# Altium schematic sheet Power19V.SchDoc
size 375 x 157 mm; SheetNumber: 1; SheetTotal: 1
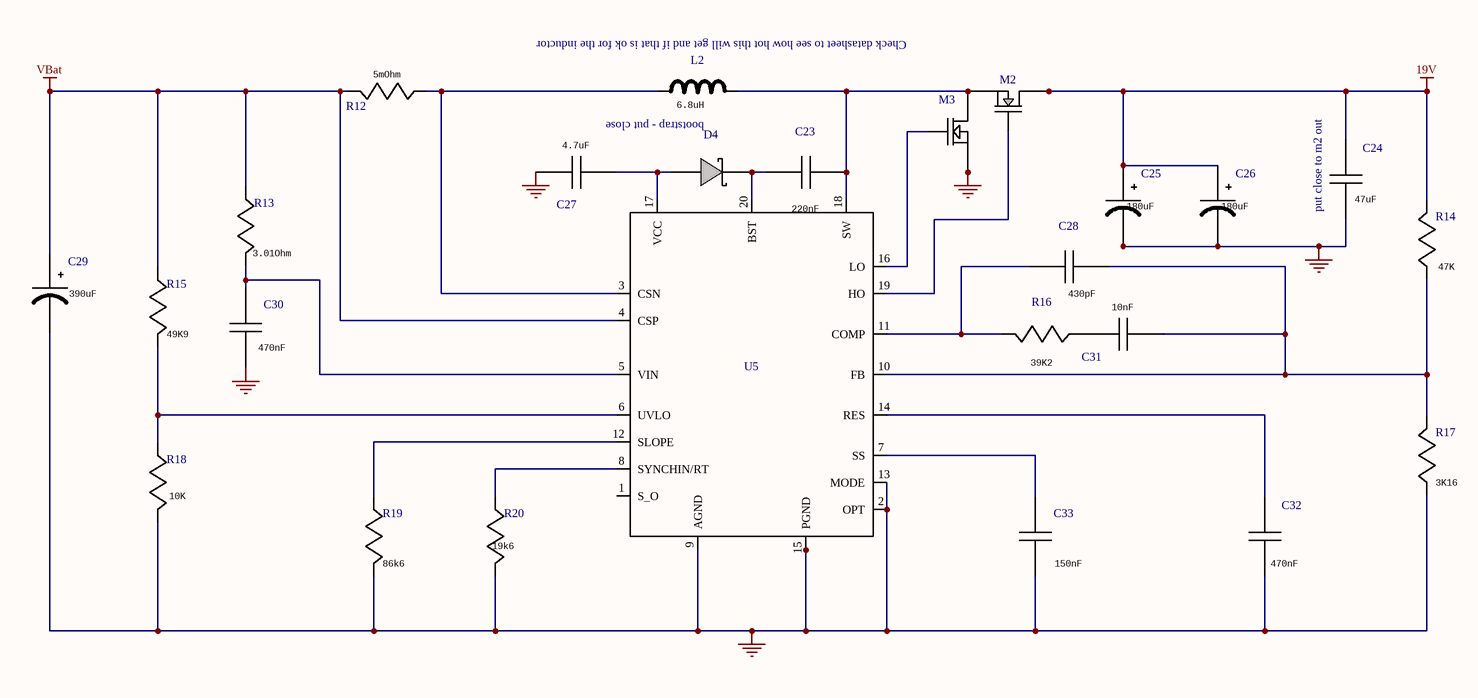
[diagram p0: Power19V.SchDoc]

## Parts
C23  value 220nF  [1608]  (hidden comment: C0805C224K5RACTU)
C24  value 47uF  [1206]  (hidden comment: C3216JB1E476M)
C25  value 180uF  [CAPSMT_62_E12]  (hidden comment: 25SVPF180M)
C26  value 180uF  [CAPSMT_62_E12]  (hidden comment: 25SVPF180M)
C27  value 4.7uF  [1608]  (hidden comment: GRM21BC81E475KA1)
C28  value 430pF  [1608]  (hidden comment: CL21C431JBANNNC)
C29  value 390uF  [CAPSMT_62_E12]  (hidden comment: 20SVPF390M)
C30  value 470nF  [1608]  (hidden comment: GRM188R71C474KA8)
C31  value 10nF  [1608]  (hidden comment: GRM216R71H103KA0)
C32  value 470nF  [1608]  (hidden comment: TMK212BJ474KD-T)
C33  value 150nF  [1608]  (hidden comment: GRM155R61A154KE1)
D4  MBR130T1G  [SOD-123]  (value not drawn)
L2  value 6.8uH  [XAL1010]  (hidden comment: XAL1010-682MEB)
M2  CSD16340Q3  [TRANS_NexFET_Q3]  (value not drawn)
M3  BSZ035N03MS G  [PG-TSDSON-8]  (value not drawn)
R12  value 5mOhm  [1608]  (hidden comment: PRL1632-R005-F-T)
R13  value 3.01Ohm  [1608]  (hidden comment: CRCW08053R01FKEA)
R14  value 47K  [1608]  (hidden comment: RR1220P-473-D)
R15  value 49K9  [1608]  (hidden comment: CRCW040249K9FKED)
R16  value 39K2  [1608]  (hidden comment: CRCW040239K2FKED)
R17  value 3K16  [1608]  (hidden comment: CRCW04023K16FKED)
R18  value 10K  [1608]  (hidden comment: CRCW040210K0FKED)
R19  value 86k6  [1608]  (hidden comment: CRCW040286K6FKED)
R20  value 19k6  [1608]  (hidden comment: CRCW040219K6FKED)
U5  LM5122MH/NOPB  [MXA20A]  (value not drawn)

## Nets
19V: C24.1 C25.1(+) C26.1(+) M2.5(Drain) M2.6(Drain) M2.7(Drain) M2.8(Drain) M2.9(Drain) R14.1
GND: C24.2 C25.2(-) C26.2(-) C27.1 C29.2(-) C30.2 C32.2 C33.2 M3.1(Source) M3.2(Source) M3.3(Source) R17.2 R18.1 R19.1 R20.1 U5.2(OPT) U5.9(AGND) U5.13(MODE) U5.15(PGND) U5.21(PGND)
VBat: C29.1(+) R12.1 R13.2 R15.2 U5.4(CSP)
NetC23_1: C23.1 D4.1(K) U5.20(BST)
NetC23_2: C23.2 L2.2 M2.1(Source) M2.2(Source) M2.3(Source) M3.5(Drain) M3.6(Drain) M3.7(Drain) M3.8(Drain) M3.9(Drain) U5.18(SW)
NetC27_2: C27.2 D4.2(A) U5.17(VCC)
NetC28_1: C28.1 C31.1 R14.2 R17.1 U5.10(FB)
NetC28_2: C28.2 R16.1 U5.11(COMP)
NetC30_1: C30.1 R13.1 U5.5(VIN)
NetC31_2: C31.2 R16.2
NetC32_1: C32.1 U5.14(RES)
NetC33_1: C33.1 U5.7(SS)
NetL2_1: L2.1 R12.2 U5.3(CSN)
NetM2_4: M2.4(Gate) U5.19(HO)
NetM3_4: M3.4(Gate) U5.16(LO)
NetR15_1: R15.1 R18.2 U5.6(UVLO)
NetR19_2: R19.2 U5.12(SLOPE)
NetR20_2: R20.2 U5.8(SYNCHIN/RT)

Not connected (* = marked no-connect by the designer): U5 1(S_O)

## Notes on the sheet
- Check datasheet to see how hot this will get and if that is ok for the inductor
- bootstrap - put close
- (near C24) put close to m2 out

## Library data of the parts
C23 = C0805C224K5RACTU: Imported; Vendor: Kemet; rn: Cbst; Manufacturer_Part_Number: C0805C224K5RACTU; Manufacturer_Name: Kemet; RefDes: RefDes; TYPE: TYPE
C24 = C3216JB1E476M: Imported; Vendor: TDK; rn: Coutx; Manufacturer_Part_Number: C3216JB1E476M; Manufacturer_Name: TDK; RefDes: RefDes; TYPE: TYPE
C25 C26 = 25SVPF180M: Imported; Vendor: Panasonic; rn: Cout; Manufacturer_Part_Number: 25SVPF180M; Manufacturer_Name: Panasonic; RefDes: RefDes; TYPE: TYPE
C27 = GRM21BC81E475KA1: Imported; Manufacturer_Part_Number: GRM21BC81E475KA12L; Vendor: MuRata; rn: Cvcc; Manufacturer_Name: MuRata; RefDes: RefDes; TYPE: TYPE
C28 = CL21C431JBANNNC: Imported; Vendor: Samsung Electro-Mechanics; rn: Ccomp2; Manufacturer_Part_Number: CL21C431JBANNNC; Manufacturer_Name: Samsung Electro-Mechanics; RefDes: RefDes; TYPE: TYPE
C29 = 20SVPF390M: Imported; Vendor: Panasonic; RN: Cin; Manufacturer_Part_Number: 20SVPF390M; Manufacturer_Name: Panasonic; RefDes: RefDes; TYPE: TYPE
C30 = GRM188R71C474KA8: Imported; Manufacturer_Part_Number: GRM188R71C474KA88D; Vendor: MuRata; rn: Cvin; Manufacturer_Name: MuRata; RefDes: RefDes; TYPE: TYPE
C31 = GRM216R71H103KA0: Imported; Manufacturer_Part_Number: GRM216R71H103KA01D; Vendor: MuRata; rn: Ccomp; Manufacturer_Name: MuRata; RefDes: RefDes; TYPE: TYPE
C32 = TMK212BJ474KD-T: Imported; Vendor: Taiyo Yuden; rn: Cres; Manufacturer_Part_Number: TMK212BJ474KD-T; Manufacturer_Name: Taiyo Yuden; RefDes: RefDes; TYPE: TYPE
C33 = GRM155R61A154KE1: Imported; Manufacturer_Part_Number: GRM155R61A154KE19D; Vendor: MuRata; rn: Css; Manufacturer_Name: MuRata; RefDes: RefDes; TYPE: TYPE
D4 = MBR130T1G: Imported; Vendor: ON Semiconductor; rn: Dbst; Value: Value; Manufacturer_Part_Number: MBR130T1G; Manufacturer_Name: ON Semiconductor; RefDes: RefDes; Type: Type
L2 = XAL1010-682MEB: Imported; Vendor: Coilcraft; Manufacturer_Part_Number: XAL1010-682MEB; Manufacturer_Name: Coilcraft; RefDes: RefDes; TYPE: TYPE
M2 = CSD16340Q3: Imported; Vendor: Texas Instruments; Value: Value; Manufacturer_Part_Number: CSD16340Q3; Manufacturer_Name: Texas Instruments; RefDes: RefDes; TYPE: TYPE
M3 = BSZ035N03MS G: Imported; Vendor: Infineon Technologies; Value: Value; Manufacturer_Part_Number: BSZ035N03MS G; Manufacturer_Name: Infineon Technologies; RefDes: RefDes; TYPE: TYPE
R12 = PRL1632-R005-F-T: Imported; Manufacturer_Part_Number: PRL1632-R005-F-T1; Vendor: Susumu Co Ltd; rn: Rs; Manufacturer_Name: Susumu Co Ltd; RefDes: RefDes; TYPE: TYPE
R13 = CRCW08053R01FKEA: Imported; Vendor: Vishay-Dale; rn: Rvin; Manufacturer_Part_Number: CRCW08053R01FKEA; Manufacturer_Name: Vishay-Dale; RefDes: RefDes; TYPE: TYPE
R14 = RR1220P-473-D: Imported; Vendor: Susumu Co Ltd; rn: Rfbt; Manufacturer_Part_Number: RR1220P-473-D; Manufacturer_Name: Susumu Co Ltd; RefDes: RefDes; TYPE: TYPE
R15 = CRCW040249K9FKED: Imported; Vendor: Vishay-Dale; rn: Ruvt; Manufacturer_Part_Number: CRCW040249K9FKED; Manufacturer_Name: Vishay-Dale; RefDes: RefDes; TYPE: TYPE
R16 = CRCW040239K2FKED: Imported; Vendor: Vishay-Dale; rn: Rcomp; Manufacturer_Part_Number: CRCW040239K2FKED; Manufacturer_Name: Vishay-Dale; RefDes: RefDes; TYPE: TYPE
R17 = CRCW04023K16FKED: Imported; Vendor: Vishay-Dale; rn: Rfbb; Manufacturer_Part_Number: CRCW04023K16FKED; Manufacturer_Name: Vishay-Dale; RefDes: RefDes; TYPE: TYPE
R18 = CRCW040210K0FKED: Imported; Vendor: Vishay-Dale; rn: Ruvb; Manufacturer_Part_Number: CRCW040210K0FKED; Manufacturer_Name: Vishay-Dale; RefDes: RefDes; TYPE: TYPE
R19 = CRCW040286K6FKED: Imported; Vendor: Vishay-Dale; rn: Rslope; Manufacturer_Part_Number: CRCW040286K6FKED; Manufacturer_Name: Vishay-Dale; RefDes: RefDes; TYPE: TYPE
R20 = CRCW040219K6FKED: Imported; Vendor: Vishay-Dale; rn: Rt; Manufacturer_Part_Number: CRCW040219K6FKED; Manufacturer_Name: Vishay-Dale; RefDes: RefDes; TYPE: TYPE
U5 = LM5122MH/NOPB: Imported; Vendor: Texas Instruments; Value: Value; Manufacturer_Part_Number: LM5122MH/NOPB; Manufacturer_Name: Texas Instruments; RefDes: RefDes; TYPE: TYPE